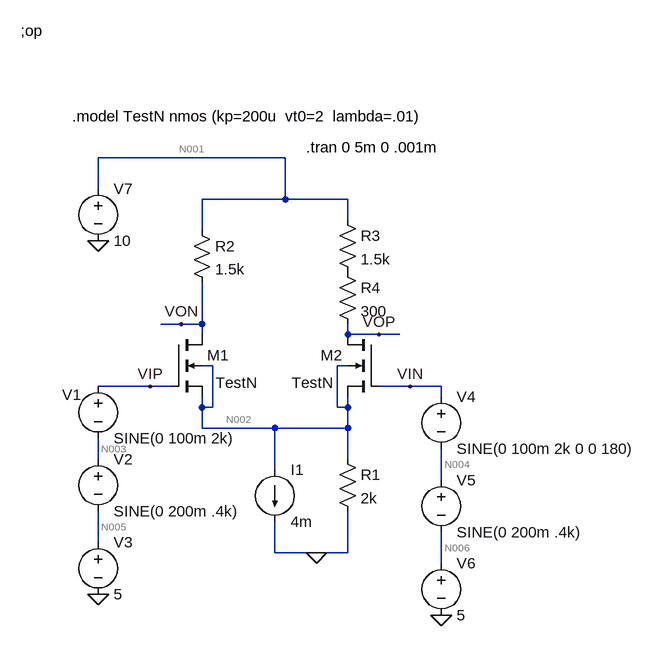
[diagram p0: schematic Draft1.asc]
Draft1.asc, the LTspice schematic file:
Version 4
SHEET 1 1032 680
WIRE 224 -224 -64 -224
WIRE -64 -176 -64 -224
WIRE 224 -160 224 -224
WIRE 224 -160 96 -160
WIRE 320 -160 224 -160
WIRE 320 -128 320 -160
WIRE 96 -112 96 -160
WIRE 64 32 32 32
WIRE 96 32 96 -32
WIRE 96 32 64 32
WIRE 96 48 96 32
WIRE 320 48 320 32
WIRE 368 48 320 48
WIRE 400 48 368 48
WIRE 112 96 96 96
WIRE 320 96 304 96
WIRE 16 128 -64 128
WIRE 48 128 16 128
WIRE 416 128 368 128
WIRE 464 128 416 128
WIRE 464 144 464 128
WIRE 96 160 96 144
WIRE 112 160 112 96
WIRE 112 160 96 160
WIRE 304 160 304 96
WIRE 320 160 320 144
WIRE 320 160 304 160
WIRE 96 192 96 160
WIRE 208 192 96 192
WIRE 320 192 320 160
WIRE 320 192 208 192
WIRE -64 240 -64 208
WIRE 320 240 320 192
WIRE 208 256 208 192
WIRE 464 272 464 224
WIRE -64 368 -64 320
WIRE 208 384 208 336
WIRE 272 384 208 384
WIRE 320 384 320 320
WIRE 320 384 272 384
WIRE 464 400 464 352
FLAG 272 384 0
FLAG -64 448 0
FLAG 464 480 0
FLAG -64 -96 0
FLAG 64 32 VON
FLAG 368 48 VOP
FLAG 16 128 VIP
FLAG 416 128 VIN
DATAFLAG -16 128 ""
SYMBOL nmos4 48 48 R0
WINDOW 3 69 74 Left 2
SYMATTR InstName M1
SYMATTR Value TestN
SYMATTR Value2 l=.2u w=1u
SYMBOL nmos4 368 48 M0
WINDOW 3 70 74 Left 2
SYMATTR InstName M2
SYMATTR Value TestN
SYMATTR Value2 l=.2u w=1u
SYMBOL current 208 256 R0
WINDOW 123 0 0 Left 0
WINDOW 39 0 0 Left 0
SYMATTR InstName I1
SYMATTR Value 4m
SYMBOL res 304 224 R0
SYMATTR InstName R1
SYMATTR Value 2k
SYMBOL voltage -64 112 R0
WINDOW 0 -55 29 Left 2
WINDOW 123 0 0 Left 0
WINDOW 39 0 0 Left 0
SYMATTR InstName V1
SYMATTR Value SINE(0 100m 2k)
SYMBOL voltage -64 224 R0
WINDOW 123 0 0 Left 0
WINDOW 39 0 0 Left 0
SYMATTR InstName V2
SYMATTR Value SINE(0 200m .4k)
SYMBOL voltage -64 352 R0
WINDOW 123 0 0 Left 0
WINDOW 39 0 0 Left 0
SYMATTR InstName V3
SYMATTR Value 5
SYMBOL voltage 464 128 R0
WINDOW 123 0 0 Left 0
WINDOW 39 0 0 Left 0
SYMATTR InstName V4
SYMATTR Value SINE(0 100m 2k 0 0 180)
SYMBOL voltage 464 256 R0
WINDOW 123 0 0 Left 0
WINDOW 39 0 0 Left 0
SYMATTR InstName V5
SYMATTR Value SINE(0 200m .4k)
SYMBOL voltage 464 384 R0
WINDOW 123 0 0 Left 0
WINDOW 39 0 0 Left 0
SYMATTR InstName V6
SYMATTR Value 5
SYMBOL res 80 -128 R0
SYMATTR InstName R2
SYMATTR Value 1.5k
SYMBOL res 304 -144 R0
SYMATTR InstName R3
SYMATTR Value 1.5k
SYMBOL voltage -64 -192 R0
WINDOW 123 0 0 Left 0
WINDOW 39 0 0 Left 0
SYMATTR InstName V7
SYMATTR Value 10
SYMBOL res 304 -64 R0
SYMATTR InstName R4
SYMATTR Value 300
TEXT -104 -288 Left 2 !.model TestN nmos (kp=200u  vt0=2  lambda=.01)
TEXT -183 -419 Left 2 !;op
TEXT 256 -240 Left 2 !.tran 0 5m 0 .001m

The netlist it stands for:
* Draft1.asc
M1 VON VIP N002 N002 TestN l=.2u w=1u
M2 VOP VIN N002 N002 TestN l=.2u w=1u
I1 N002 0 4m
R1 N002 0 2k
V1 VIP N003 SINE(0 100m 2k)
V2 N003 N005 SINE(0 200m .4k)
V3 N005 0 5
V4 VIN N004 SINE(0 100m 2k 0 0 180)
V5 N004 N006 SINE(0 200m .4k)
V6 N006 0 5
R2 N001 VON 1.5k
R3 N001 P001 1.5k
V7 N001 0 10
R4 P001 VOP 300
.model NMOS NMOS
.model PMOS PMOS
.lib standard.mos
.model TestN nmos (kp=200u  vt0=2  lambda=.01)
;op
.tran 0 5m 0 .001m
.backanno
.end

* Results of the author's LTspice run, read from the files saved beside the schematic
* Operating Point, zero values left out:
*   V(von) = 6.637 V
*   V(vip) = 5 V
*   V(n002) = 940.3 mV
*   V(vop) = 5.989 V
*   V(vin) = 5 V
*   V(n003) = 5 V
*   V(n005) = 5 V
*   V(n004) = 5 V
*   V(n006) = 5 V
*   V(n001) = 10 V
*   V(p001) = 6.658 V
*   Id(M2) = 2.228 mA
*   Ib(M2) = -5.059 pA
*   Is(M2) = -2.228 mA
*   Id(M1) = 2.242 mA
*   Ib(M1) = -5.707 pA
*   Is(M1) = -2.242 mA
*   I(I1) = 4 mA
*   I(R4) = 2.228 mA
*   I(R3) = 2.228 mA
*   I(R2) = 2.242 mA
*   I(R1) = 470.2 µA
*   I(V7) = -4.47 mA
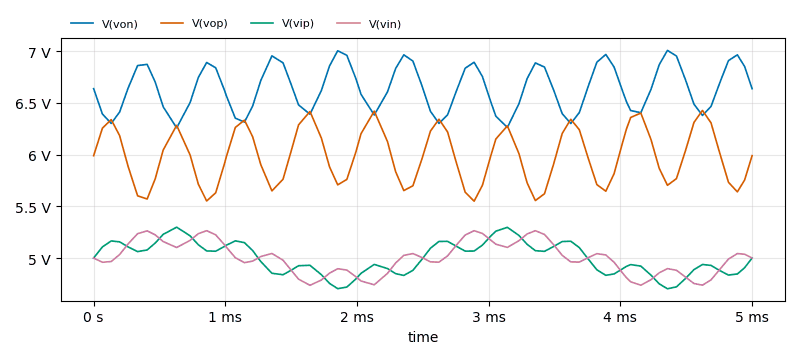
[diagram p1: Transient Analysis of Draft1.asc, plotted from the saved traces]
* Transient Analysis, 1 run:
*   V(von): min 6.258 V, max 7.007 V, average 6.639 V, rms 6.643 V, last 6.637 V
*   V(vop): min 5.55 V, max 6.427 V, average 5.986 V, rms 5.992 V, last 5.989 V
*   V(vip): min 4.703 V, max 5.298 V, average 4.999 V, rms 5.002 V, last 5 V
*   V(vin): min 4.736 V, max 5.264 V, average 5.001 V, rms 5.003 V, last 5 V